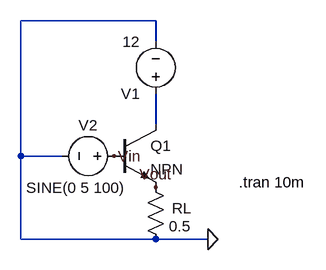
[diagram p0: schematic class B.asc]
class B.asc, the LTspice schematic file:
Version 4
SHEET 1 880 680
WIRE 208 -48 0 -48
WIRE 208 -16 208 -48
WIRE 208 112 208 64
WIRE 0 160 0 -48
WIRE 64 160 0 160
WIRE 0 288 0 160
WIRE 208 288 0 288
WIRE 288 288 208 288
FLAG 288 288 0
FLAG 144 160 Vin
FLAG 208 208 Vout
SYMBOL npn 144 112 R0
SYMATTR InstName Q1
SYMBOL res 192 192 R0
WINDOW 0 41 48 Left 2
SYMATTR InstName RL
SYMATTR Value 0.5
SYMBOL voltage 208 80 R180
WINDOW 123 0 0 Left 0
WINDOW 39 0 0 Left 0
SYMATTR InstName V1
SYMATTR Value 12
SYMBOL voltage 160 160 R90
WINDOW 0 -32 56 VBottom 2
WINDOW 3 33 75 VTop 2
WINDOW 123 0 0 Left 0
WINDOW 39 0 0 Left 0
SYMATTR InstName V2
SYMATTR Value SINE(0 5 100)
TEXT 336 200 Left 2 !.tran 10m

The netlist it stands for:
* class B.asc
Q1 N001 Vin Vout 0 NPN
RL Vout 0 0.5
V1 N001 0 12
V2 Vin 0 SINE(0 5 100)
.model NPN NPN
.model PNP PNP
.lib standard.bjt
.tran 10m
.backanno
.end